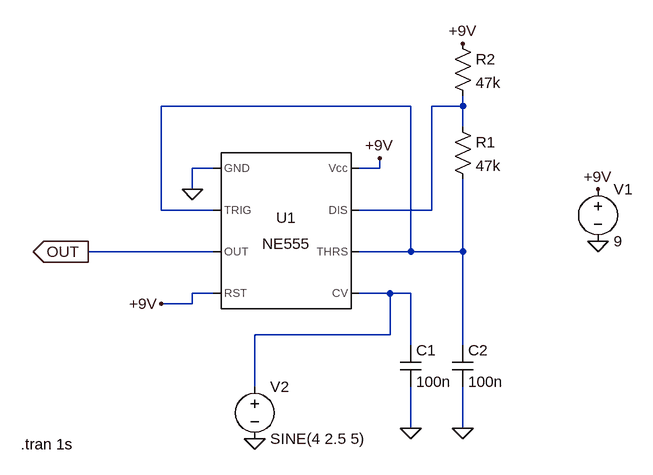
[diagram p0: schematic 555_timer_vco.asc]
555_timer_vco.asc, the LTspice schematic file:
Version 4
SHEET 1 880 680
WIRE 432 -16 48 -16
WIRE 512 -16 512 -32
WIRE 512 -16 464 -16
WIRE 512 16 512 -16
WIRE 128 80 96 80
WIRE 384 80 384 64
WIRE 384 80 352 80
WIRE 96 112 96 80
WIRE 48 144 48 -16
WIRE 128 144 48 144
WIRE 464 144 464 -16
WIRE 464 144 352 144
WIRE 128 208 -64 208
WIRE 432 208 432 -16
WIRE 432 208 352 208
WIRE 512 208 512 96
WIRE 512 208 432 208
WIRE 128 272 96 272
WIRE 400 272 352 272
WIRE 432 272 400 272
WIRE 96 288 96 272
WIRE 96 288 48 288
WIRE 400 336 400 272
WIRE 400 336 192 336
WIRE 432 352 432 272
WIRE 512 352 512 208
WIRE 192 416 192 336
WIRE 432 480 432 416
WIRE 512 480 512 416
FLAG 432 480 0
FLAG 512 480 0
FLAG 720 192 0
FLAG 720 112 +9V
FLAG 512 -112 +9V
FLAG 384 64 +9V
FLAG -64 208 OUT
IOPIN -64 208 Out
FLAG 96 112 0
FLAG 48 288 +9V
FLAG 192 496 0
SYMBOL Misc\\NE555 240 176 R0
SYMATTR InstName U1
SYMBOL cap 416 352 R0
SYMATTR InstName C1
SYMATTR Value 100n
SYMBOL cap 496 352 R0
SYMATTR InstName C2
SYMATTR Value 100n
SYMBOL res 496 0 R0
SYMATTR InstName R1
SYMATTR Value 47k
SYMBOL res 496 -128 R0
SYMATTR InstName R2
SYMATTR Value 47k
SYMBOL voltage 720 96 R0
WINDOW 123 0 0 Left 0
WINDOW 39 0 0 Left 0
SYMATTR InstName V1
SYMATTR Value 9
SYMBOL voltage 192 400 R0
WINDOW 123 0 0 Left 0
WINDOW 39 0 0 Left 0
SYMATTR InstName V2
SYMATTR Value SINE(4 2.5 5)
TEXT -168 504 Left 2 !.tran 1s

The netlist it stands for:
* 555_timer_vco.asc
XU1 0 N001 OUT +9V N003 N001 N002 +9V NE555  ; pins GND TRIG OUT RST CV THRS DIS Vcc
C1 N003 0 100n
C2 N001 0 100n
R1 N002 N001 47k
R2 +9V N002 47k
V1 +9V 0 9
V2 N003 0 SINE(4 2.5 5)
.tran 1s
.lib NE555.sub
.backanno
.end